# EAGLE design sch (EAGLE 7.5.0)
Schematic of hackwallet. Author: SL-RU https://github.com/SL-RU/hackwal
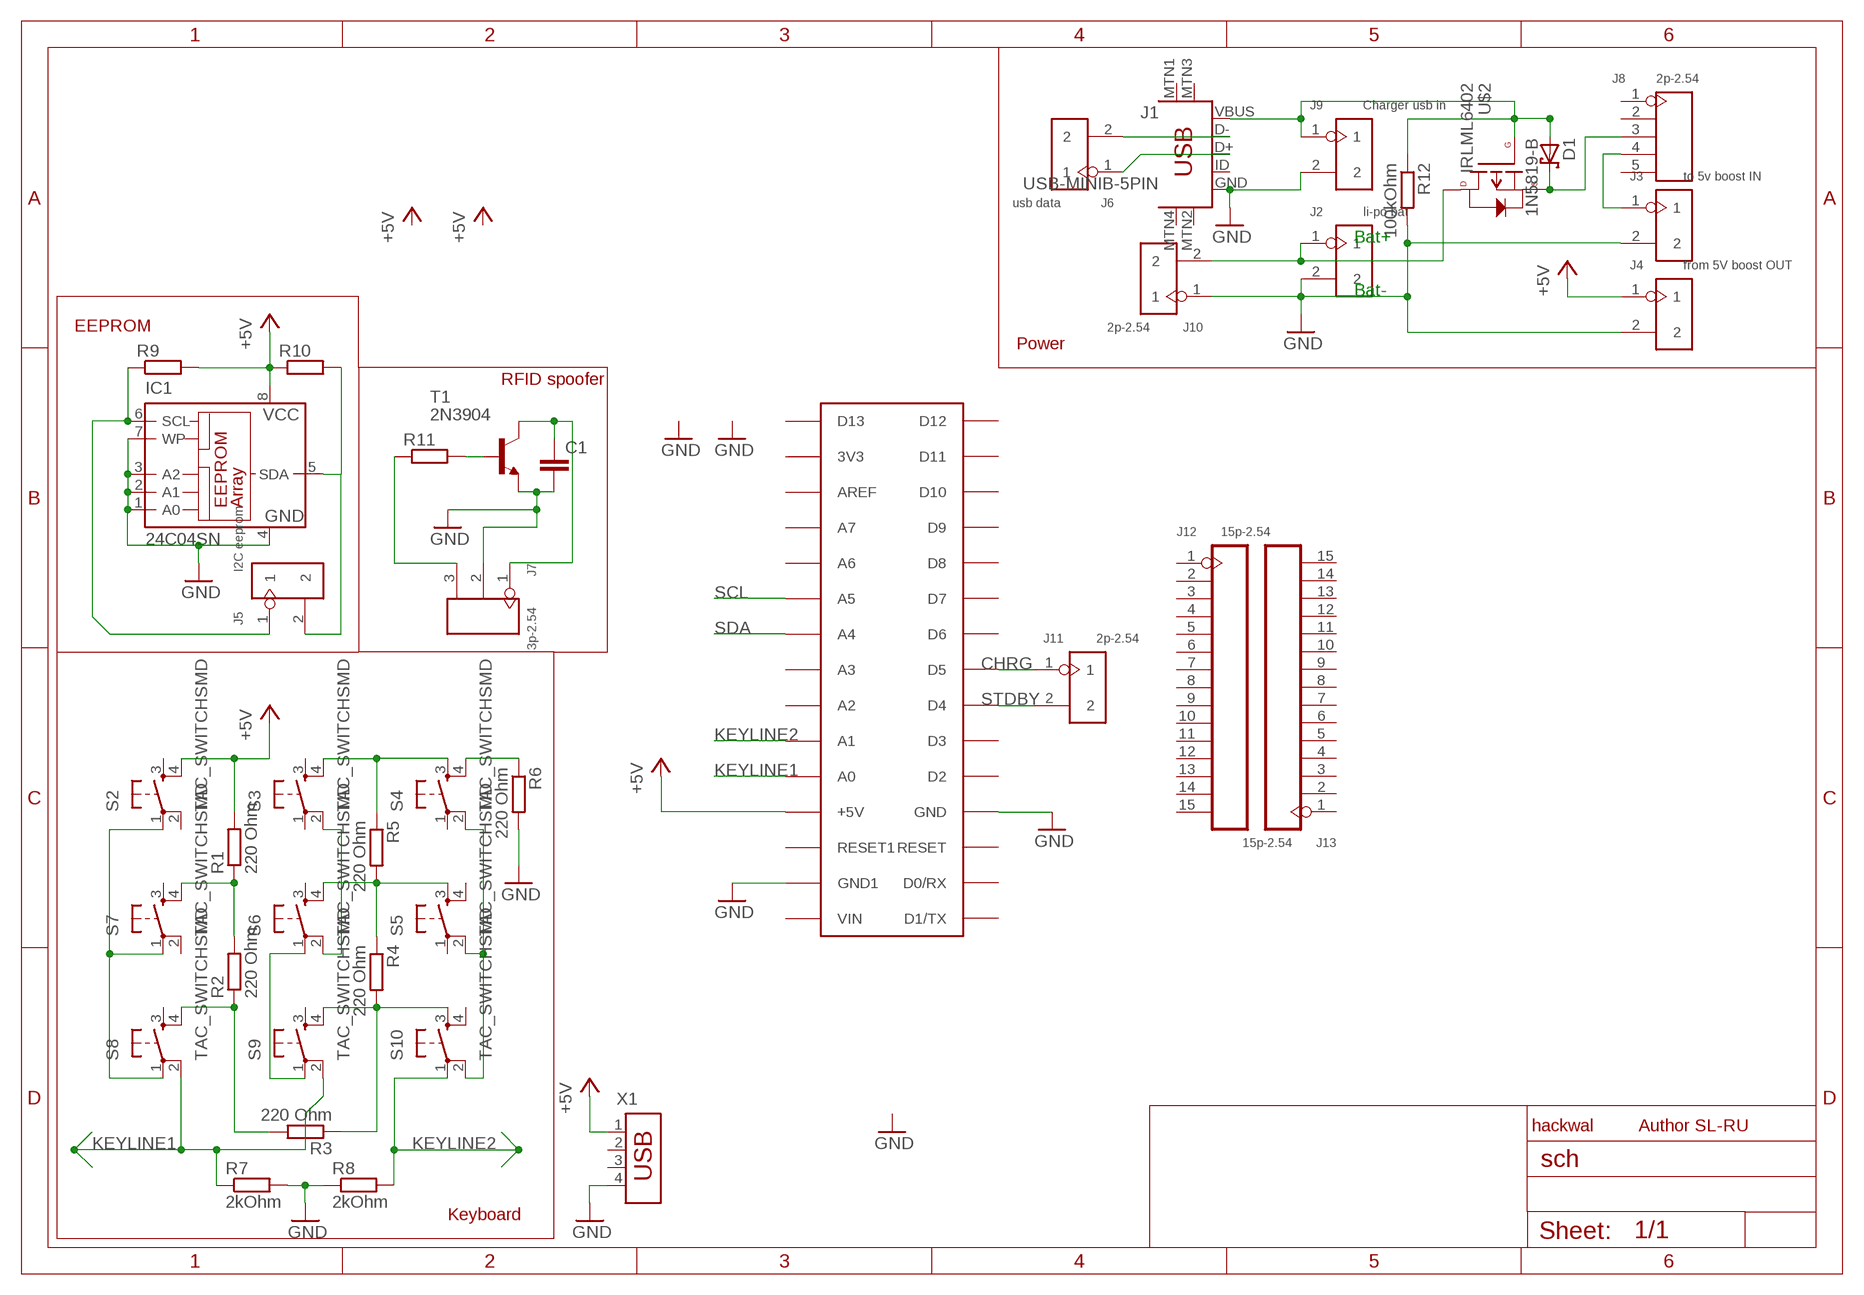
[diagram p0: schematic, sheet 1]

## Parts
C1  C5/3  [C5B3]
D1  1N5819-B  [DO41-7.6]
IC1  24C04SN  [SO-08]
J1  USB-MINIB-5PIN  [USB-MINIB]
J2  li-po bat  DIP-BLACK-MALE-HEADER-VERT(2P-2.54)  [H2-2.54]
J3  to 5v boost IN  DIP-BLACK-FEMALE-HEADER-VERT(2P-2.54)  [H2-2.54]
J4  from 5V boost OUT  DIP-BLACK-FEMALE-HEADER-VERT(2P-2.54)  [H2-2.54]
J5  I2C eeprom  DIP-BLACK-FEMALE-HEADER-VERT(2P-2.54)  [H2-2.54]
J6  usb data  DIP-BLACK-FEMALE-HEADER-VERT(2P-2.54)  [H2-2.54]
J7  3p-2.54  DIP-BLACK-FEMALE-HEADER-VERT(3P-2.54)  [H3-2.54]
J8  2p-2.54  DIP-BLACK-MALE-HEADER-VERT(5P-2.54)  [H5-2.54]
J9  Charger usb in  DIP-BLACK-MALE-HEADER-VERT(2P-2.54)  [H2-2.54]
J10  2p-2.54  DIP-BLACK-MALE-HEADER-VERT(2P-2.54)  [H2-2.54]
J11  2p-2.54  DIP-BLACK-MALE-HEADER-VERT(2P-2.54)  [H2-2.54]
J12  15p-2.54  DIP-BLACK-FEMALE-HEADER-VERT(15P-2.54)  [H15-2.54]
J13  15p-2.54  DIP-BLACK-FEMALE-HEADER-VERT(15P-2.54)  [H15-2.54]
R1  220 Ohm  R-EU_0207/10  [0207/10]
R2  220 Ohm  R-EU_0207/10  [0207/10]
R3  220 Ohm  R-EU_0207/10  [0207/10]
R4  220 Ohm  R-EU_0207/10  [0207/10]
R5  220 Ohm  R-EU_0207/10  [0207/10]
R6  220 Ohm  R-EU_0207/10  [0207/10]
R7  2kOhm  R-EU_0207/10  [0207/10]
R8  2kOhm  R-EU_0207/10  [0207/10]
R9  R-EU_0207/10  [0207/10]
R10  R-EU_0207/10  [0207/10]
R11  R-EU_0207/10  [0207/10]
R12  100kOhm  R-EU_0207/10  [0207/10]
S2  TAC_SWITCHSMD  [TACTILE-SWITCH-SMD]
S3  TAC_SWITCHSMD  [TACTILE-SWITCH-SMD]
S4  TAC_SWITCHSMD  [TACTILE-SWITCH-SMD]
S5  TAC_SWITCHSMD  [TACTILE-SWITCH-SMD]
S6  TAC_SWITCHSMD  [TACTILE-SWITCH-SMD]
S7  TAC_SWITCHSMD  [TACTILE-SWITCH-SMD]
S8  TAC_SWITCHSMD  [TACTILE-SWITCH-SMD]
S9  TAC_SWITCHSMD  [TACTILE-SWITCH-SMD]
S10  TAC_SWITCHSMD  [TACTILE-SWITCH-SMD]
T1  2N3904  [TO92]
U$1  ARDUINONANO  [PDIP-32]
U$2  IRLML6402  P-CHANNEL-MOSFET  [SOT23-3]
X1  USB-787616  [USB]

## Nets
+5V: IC1.8(VCC) J4.1 R1.2 R9.2 R10.1 S2.4 U$1.+5V X1.1
CHRG: J11.1 U$1.D5
DDDASD: IC1.5(SDA) J5.2 R10.2
DDSADSADF: IC1.6(SCL) J5.1 R9.1
GND: C1.2 IC1.1(A0) IC1.2(A1) IC1.3(A2) IC1.4(GND) IC1.7(WP) J1.GND J2.2 J3.2 J4.2 J7.2 J9.2 J10.1 R6.2 R7.2 R8.1 R12.2 T1.3(E) U$1.GND U$1.GND1 X1.4
KEYLINE1: R7.1 S8.2 S9.2 U$1.A0
KEYLINE2: R8.2 S10.1 U$1.A1
N$1: R6.1 S4.4
N$2: R5.1 S3.4 S4.3
N$3: S4.2 S5.2 S10.2
N$4: R4.1 R5.2 S5.3 S6.4
N$5: S3.2 S6.2
N$6: S6.1 S9.1
N$7: R3.1 R4.2 S9.4 S10.3
N$8: R2.1 R3.2 S8.4
N$9: R1.1 R2.2 S7.4
N$10: D1.A J1.VBUS J9.1 R12.1 U$2.1(G)
N$11: S2.1 S7.1 S8.1
N$12: J2.1 J10.2 U$2.3(D)
N$13: J1.D- J6.2
N$14: D1.C J8.3 U$2.2(S)
N$17: J1.D+ J6.1
N$18: J3.1 J8.4
N$19: R11.2 T1.2(B)
N$22: C1.1 J7.1 T1.1(C)
N$23: J7.3 R11.1
SCL: U$1.A5
SDA: U$1.A4
STDBY: J11.2 U$1.D4
Unconnected: J1.ID J1.MTN1(MTN2) J1.MTN2(MTN3) J1.MTN3(MTN1) J1.MTN4 J8.1 J8.2 J8.5 J12.1 J12.2 J12.3 J12.4 J12.5 J12.6 J12.7 J12.8 J12.9 J12.10 J12.11 J12.12 J12.13 J12.14 J12.15 J13.1 J13.2 J13.3 J13.4 J13.5 J13.6 J13.7 J13.8 J13.9 J13.10 J13.11 J13.12 J13.13 J13.14 J13.15 S2.2 S2.3 S3.1 S3.3 S4.1 S5.1 S5.4 S6.3 S7.2 S7.3 S8.3 S9.3 S10.4 U$1.3V3 U$1.A2 U$1.A3 U$1.A6 U$1.A7 U$1.AREF U$1.D0/RX U$1.D1/TX U$1.D2 U$1.D3 U$1.D6 U$1.D7 U$1.D8 U$1.D9 U$1.D10 U$1.D11 U$1.D12 U$1.D13 U$1.RESET U$1.RESET1 U$1.VIN X1.2 X1.3

## Notes on the sheet
- Bat+
- Bat-
- EEPROM
- Power
- RFID spoofer
- hackwal | Author SL-RU
- Keyboard

## Library data of the parts
C1 = capacitor-wima:C: CAPACITOR naming: grid - package width
D1 = diode:1N581*: 1.0A SCHOTTKY BARRIER RECTIFIER Source: http://www.diodes.com/datasheets/ds23001.pdf
IC1 = microchip:24C*: Serial EEPROM 1 K/2 K/4 K; MPN: M24C04-WMN6P; OC_FARNELL: 9882812; OC_NEWARK: 83K1376
J1 = SparkFun-Connectors:USB-MINIB: Mini-USB "B" connector with 5th pin broken out. Created new symbol breaking out 5th "ID" pin in mini/micro USB connector spec. See: http://en.wikipedia.org/wiki/Mini_usb#Cables. Uses same footprint as 4-pin symbol. Also added pins to connect to mounting / shield pads if required (probably not generally needed as signals aren't shielded once they leave the connector).; PROD_ID: CONN-08193
J2 J9 = Seeed-OPL-Connector:DIP-BLACK-MALE-HEADER-VERT(2P-2.54): 320020016; MPN: P125-1102A0BS116A1; VALUE: 2p-2.54
J3-J6 = Seeed-OPL-Connector:DIP-BLACK-FEMALE-HEADER-VERT(2P-2.54): 320030023; MPN: F185-1102A1BSYA1; VALUE: 2p-2.54
J7 = Seeed-OPL-Connector:DIP-BLACK-FEMALE-HEADER-VERT(3P-2.54): 320030024; MPN: F185-1103A0BSYA1
J8 = Seeed-OPL-Connector:DIP-BLACK-MALE-HEADER-VERT(5P-2.54): 320020040
J10 J11 = Seeed-OPL-Connector:DIP-BLACK-MALE-HEADER-VERT(2P-2.54): 320020016; MPN: P125-1102A0BS116A1
J12 J13 = Seeed-OPL-Connector:DIP-BLACK-FEMALE-HEADER-VERT(15P-2.54): 320030031
R1-R12 = resistor:R-EU_: RESISTOR, European symbol
S2-S10 = SparkFun-Retired:TAC_SWITCH: Momentary Switch Button commonly used for reset or general input. Spark Fun Electronics SKU : COM-00097 SMT- SWCH-08247; PROD_ID: SWCH-08247
T1 = transistor:2N3904: NPN TRANSISTOR
U$1 = jet-lib(1):ARDUINONANO
U$2 = GeekAmmo:P-CHANNEL-MOSFET: P-Channel MOSFET Mode Field Effect Transistor
X1 = con-amp:USB-787616: AMP connector

## Board
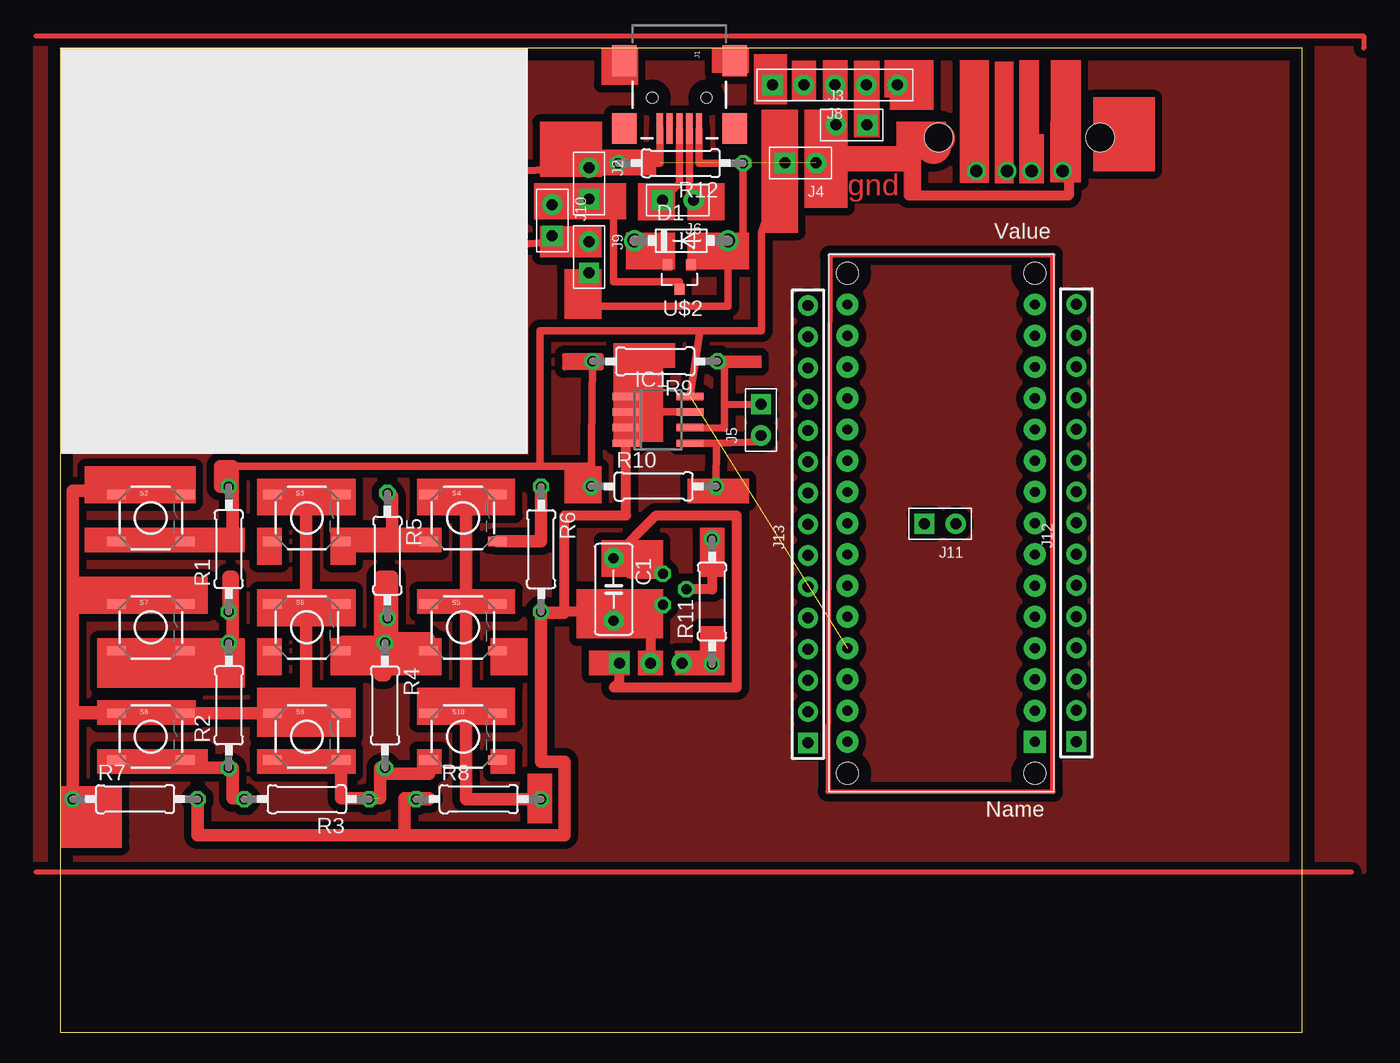
[diagram p1: board, top side]
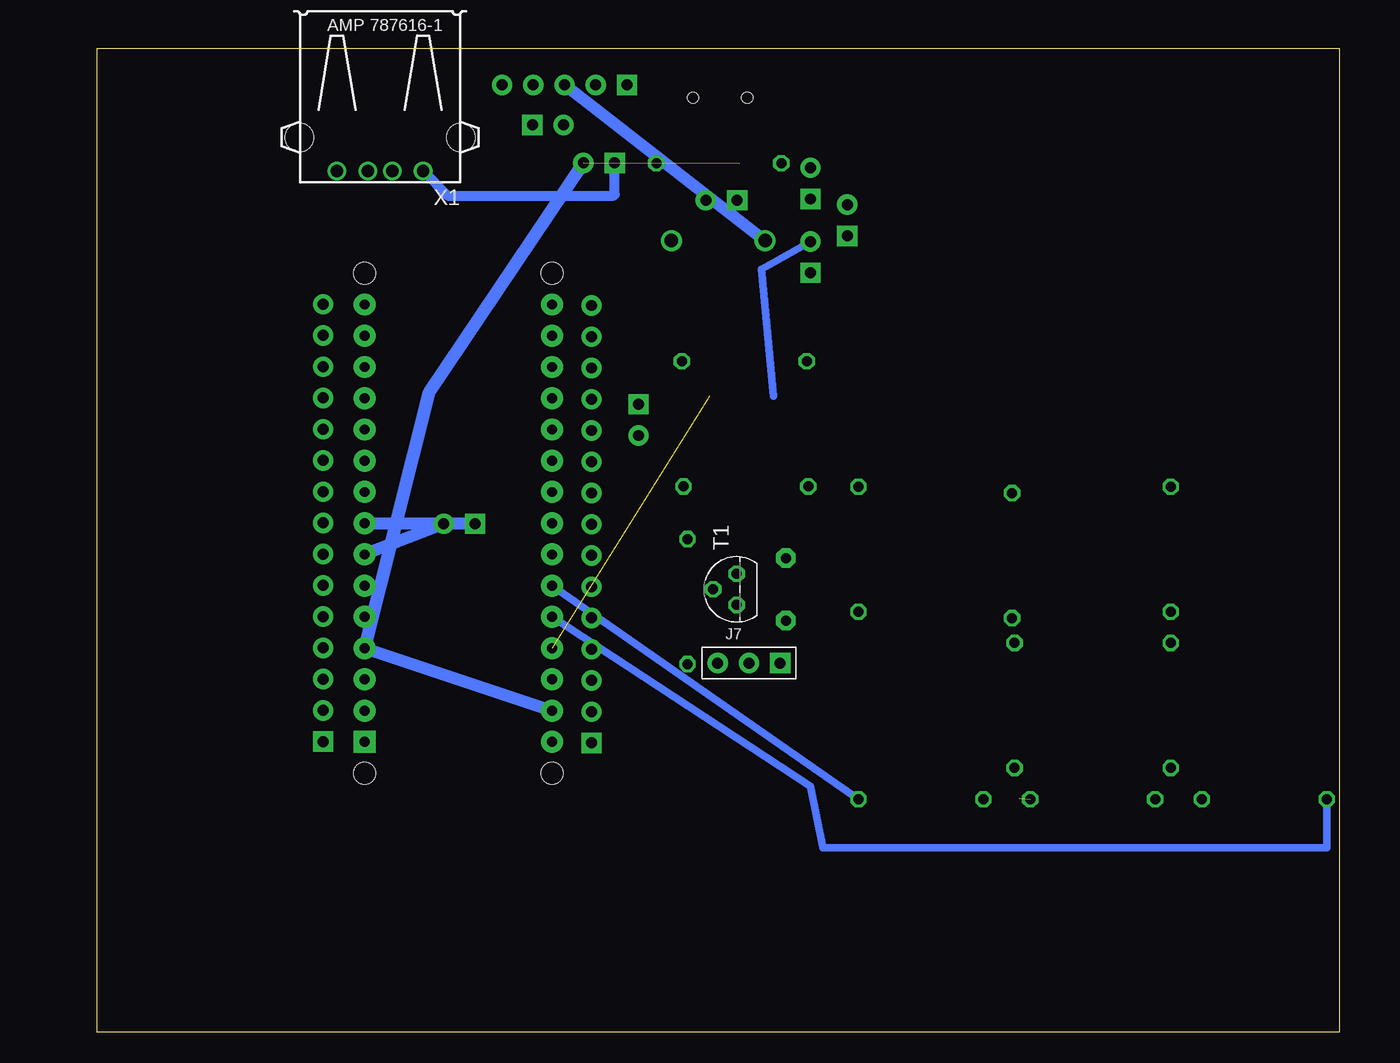
[diagram p2: board, bottom side, seen from below]

Size 101 x 80 mm. Coordinates in mm from the lower left corner, seen from the top.
Outline: 0,0 101,0 101,80 0,80 0,0
Copper layers (1*16): Top 0.035mm / dielectric 1.5mm / Bottom 0.035mm
Design rules "default": minimum track width 10mil, minimum drill 24mil, track to track 8mil, track to pad 8mil, pad to pad 8mil, via to via 8mil, smd to smd 8mil, copper to edge 40mil, drill to drill 8mil, minimum pad ring 10mil, minimum via ring 8mil, stop-mask expansion 4mil, vias tented up to drill 0mil, thermal gap 10mil

### Footprints (pad centres in the part's own frame; a part is rotated, then mirrored left to right if it is on the bottom)
C5B3 = drill 0.813 pad 1.6 octagon: 1 -2.54,0; 2 2.54,0
DO41-7.6 = drill 1.1 pad 1.7: A 3.81,0; C -3.81,0
SO-08 = smd 0.6 x 2.2: 1 -1.905,-2.6; 2 -0.635,-2.6; 3 0.635,-2.6; 4 1.905,-2.6; 5 1.905,2.6; 6 0.635,2.6; 7 -0.635,2.6; 8 -1.905,2.6
USB-MINIB = smd 2.5 x 0.5: D+ 2.5,0; D- 2.5,0.8; GND 2.5,-1.6; ID 2.5,-0.8; VBUS 2.5,1.6 | smd 2.5 x 2: MTN1 -3,4.5; MTN2 2.5,4.5; MTN3 -3,-4.5; MTN4 2.5,-4.5 | hole 0.9: 0,2.2; 0,-2.2
H2-2.54 = drill 0.889 pad 1.651 square: 1 0,1.27 | drill 0.889 pad 1.651: 2 0,-1.27
H3-2.54 = drill 0.889 pad 1.651 square: 1 0,2.54 | drill 0.889 pad 1.651: 2 0,0; 3 0,-2.54
H5-2.54 = drill 0.889 pad 1.651 square: 1 0,5.08 | drill 0.889 pad 1.651: 2 0,2.54; 3 0,0; 4 0,-2.54; 5 0,-5.08
H15-2.54 = drill 0.889 pad 1.651 square: 1 0,-17.78 | drill 0.889 pad 1.651: 2 0,-15.24; 3 0,-12.7; 4 0,-10.16; 5 0,-7.62; 6 0,-5.08; 7 0,-2.54; 8 0,0; 9 0,2.54; 10 0,5.08; 11 0,7.62; 12 0,10.16; 13 0,12.7; 14 0,15.24; 15 0,17.78
0207/10 = drill 0.813 octagon: 1 -5.08,0; 2 5.08,0
TACTILE-SWITCH-SMD = smd 1.524 x 0.762: 1 -2.794,1.905; 2 2.794,1.905; 3 -2.794,-1.905; 4 2.794,-1.905
TO92 = drill 0.813 octagon: 1 1.27,0; 2 0,1.905; 3 -1.27,0
PDIP-32 = drill 0.8 pad 1.778: 3V3 15.24,-35.56; +5V 15.24,-10.16; A0 15.24,-12.7; A1 15.24,-15.24; A2 15.24,-17.78; A3 15.24,-20.32; A4 15.24,-22.86; A5 15.24,-25.4; A6 15.24,-27.94; A7 15.24,-30.48; AREF 15.24,-33.02; D0/RX 0,-5.08; D2 0,-12.7; D3 0,-15.24; D4 0,-17.78; D5 0,-20.32; D6 0,-22.86; D7 0,-25.4; D8 0,-27.94; D9 0,-30.48; D10 0,-33.02; D11 0,-35.56; D12 0,-38.1; D13 15.24,-38.1; GND 0,-10.16; GND1 15.24,-5.08; RESET 0,-7.62; RESET1 15.24,-7.62; VIN 15.24,-2.54 | drill 0.8 pad 1.778 square: D1/TX 0,-2.54 | hole 1.778: 0,0; 0,-40.64; 15.24,-40.64; 15.24,0
SOT23-3 = smd 0.8 x 0.9: 1 -0.95,-1; 2 0.95,-1; 3 0,1
USB = drill 1: 1 -3.5,12.99; 2 -1,12.99; 3 1,12.99; 4 3.5,12.99 | hole 2.3: -6.57,10.28; 6.57,10.28

### Placement (x,y rotation side)
C1  45,36 270 top
D1  50.5,64.34 0 top
IC1  48.61,49.78 270 top
J1  50.35,75.96 270 top
J2  43,69 180 top
J3  64.34,73.75 270 top
J4  60.19,70.66 90 top
J5  56.98,49.77 0 top
J6  50.23,67.63 90 top
J7  48,30 270 bottom
J8  63,77 90 top
J9  43,63 180 top
J10  40,66 180 top
J11  71.55,41.32 90 top
J12  82.63,41.4 0 top
J13  60.81,41.29 0 top
R1  13.7,39.26 90 top
R2  13.7,26.56 90 top
R3  20.05,18.94 180 top
R4  26.4,26.56 270 top
R5  26.6,38.74 270 top
R6  39.1,39.26 270 top
R7  6.08,18.94 0 top
R8  34.02,18.94 0 top
R9  48.38,54.53 180 top
R10  48.25,44.36 0 top
R11  53,35 90 top
R12  50.45,70.64 180 top
S2  7.35,41.8 0 top
S3  20.05,41.8 0 top
S4  32.75,41.8 0 top
S5  32.75,32.91 0 top
S6  20.05,32.91 0 top
S7  7.35,32.91 0 top
S8  7.35,24.02 0 top
S9  20.05,24.02 0 top
S10  32.75,24.02 0 top
T1  49,36 90 bottom
U$1  79.25,21.05 180 top
U$2  50.34,61.39 180 top
X1  78,83 180 bottom

### Tracks (layer width: path | path; a pad name or v marks a point on that pad's centre or on a via)
+5V  (1 unrouted)
  Top 0.61: 14,46 39,46 | 39,46 43,46 R10.1 R9.2 | IC1.8 52,57 | 52,57 39,57 39,46 | 52,57 57,57 57,65 J4.1
  Top 1.016: S2.4 10.14,40 14,40 14,46 13,46 13,44.34 R1.2
  Bottom 0.813: X1.1 72.49,68 59,68 58.92,68.08 J4.1
CHRG
  Bottom 1.016: J11.1 U$1.D5
DDDASD
  Top 0.61: R10.2 53.35,47.88 | 53.35,47.88 51.35,47.88 IC1.5 | 53.35,47.88 57,48 J5.2
DDSADSADF
  Top 0.61: IC1.6 54,49.11 54,51 | 54,51 54,54 R9.1 | 54,51 J5.1
GND  (2 unrouted)
  Top 0.61: R12.2 48.75,70.64 J1.GND | J9.2 43,64.73 J10.1 40.35,64.25 37,64 37,70 J2.2 | J3.2 63.07,70.66 62,70.66 J4.2 | IC1.2 IC1.7 48.63,50.41
  Top 0.813: 46.01,51 46.01,42.01 46,42 41,42 41,34 39.28,34 R6.2 44.28,34.18 C1.2 47,33.46 | T1.3 49,35 47,35 47,33.46 | 47,33.46 48,33.46 J7.2 | X1.4 82,69.51 82,68 69,68 69,71 68.66,70.66 62,70.66
  Top 1.016: R8.1 30,18.94 30,19 28,19 28,16 | 28,16 11.16,16 R7.2 | R6.2 39.1,22 41,22 41,16 28,16 | J2.2 43,70.64 R12.2 | IC1.4 IC1.3 IC1.2 46.01,51 IC1.1
  Bottom 0.61: J9.2 47,62 IC1.1
  Bottom 1.016: J4.2 74,52 U$1.GND U$1.GND1
KEYLINE1
  Top 1.016: R7.1 1,26 10.14,26 S8.2 S9.2
  Bottom 0.61: U$1.A0 43,20 42,15 1,15 R7.1
KEYLINE2
  Top 1.016: R8.2 33,18.94 33,26 29.96,26 S10.1
  Bottom 0.61: R8.2 U$1.A1
N$1
  Top 1.016: S4.4 39.1,39.9 R6.1
N$2
  Top 1.016: S4.3 27,39.9 | 27,39.9 S3.4 | R5.1 arc-90 27,43.42 27,39.9
N$3
  Top 1.016: S4.2 35.54,44 33,44 33,34.81 | S5.2 33,34.81 | 33,34.81 33,25.93 S10.2
N$4
  Top 0.406: 26,32 22.84,32 S6.4
  Top 1.016: R4.1 26.4,29 26,29 26,32 | 26,32 26,34.26 | 26,34.26 26,37 27,37 27,32 | 27,32 26,32 | S5.3 29.96,32 27,32 | R5.2 arc-90 26,34.26
N$5
  Top 1.016: S3.2 arc90 22.55,44 20,44 20,35 arc90 20.18,34.81 S6.2
N$6
  Top 1.016: S9.1 17.26,26 20,26 20,34.81 S6.1
N$7  (1 unrouted)
  Top 1.016: S9.4 22.84,19 26,19 26,21.48 R4.2 26.4,21 30,21 30,22.11 S10.3
N$8
  Top 1.016: R3.2 14.97,19 14,19 14,21.48 R2.1 10.78,21.48 S8.4
N$9
  Top 0.406: S7.4 14,31
  Top 1.016: R1.1 13.7,37 14,37 14,31.64 | 14,29 14,31 14,31.64 | 14,31.64 R2.2
N$10
  Top 0.61: J1.VBUS 51.95,70.64 R12.1 55.53,64.34 D1.A | U$2.1 54.31,62.39 D1.A | J9.1 43,59 54.31,59 D1.A
N$11
  Top 1.016: 1,19 1,25.93 S8.1 4.56,26 1,26 1,34.81 | 1,34.81 S7.1 | S2.1 4.56,44 1,44 1,34.81
N$12
  Top 0.61: U$2.3 50.34,61 45,61 45,67.73 J2.1 43,67.27 J10.2
N$13
  Top 0.61: J1.D- 51.15,67.63 J6.2
N$14
  Top 0.61: U$2.2 46.69,62.39 D1.C
  Bottom 1.016: D1.C J8.3
N$16
  Top 0.406: 43,54 41,54 41,55 43,55 | 43,55 43,54 | 43,54 44,54 44,55 43,55
N$17
  Top 0.61: J6.1 50.35,69.02 J1.D+
N$18
  Top 0.61: J8.4 65.61,77 J3.1
N$19
  Top 0.813: R11.2 53,36 T1.2
N$22
  Top 0.813: J7.1 45.46,28.46 45,28 55,28 55,42 48.46,42 C1.1 46.27,37.27 T1.1
N$23
  Top 0.813: R11.1 53,30 J7.3
N$25
  Top 0.406: 80.72,63.16 62.58,63.12 62.42,19.57 80.73,19.53 80.72,63.16
N$26
  pour Top (isolate 0.61): -2,81 106,81 106,13 -2,13
N$27
  Top 0.406: -2,81 106,81 106,80
N$28
  Top 0.406: 105,13 -2,13
STDBY
  Bottom 1.016: J11.2 U$1.D4
(copper drawn outside any net)
  shapes: Top area x77, Top circle x2

### Text on the board
Top: gnd